# Altium project pcb大作业.PrjPCB
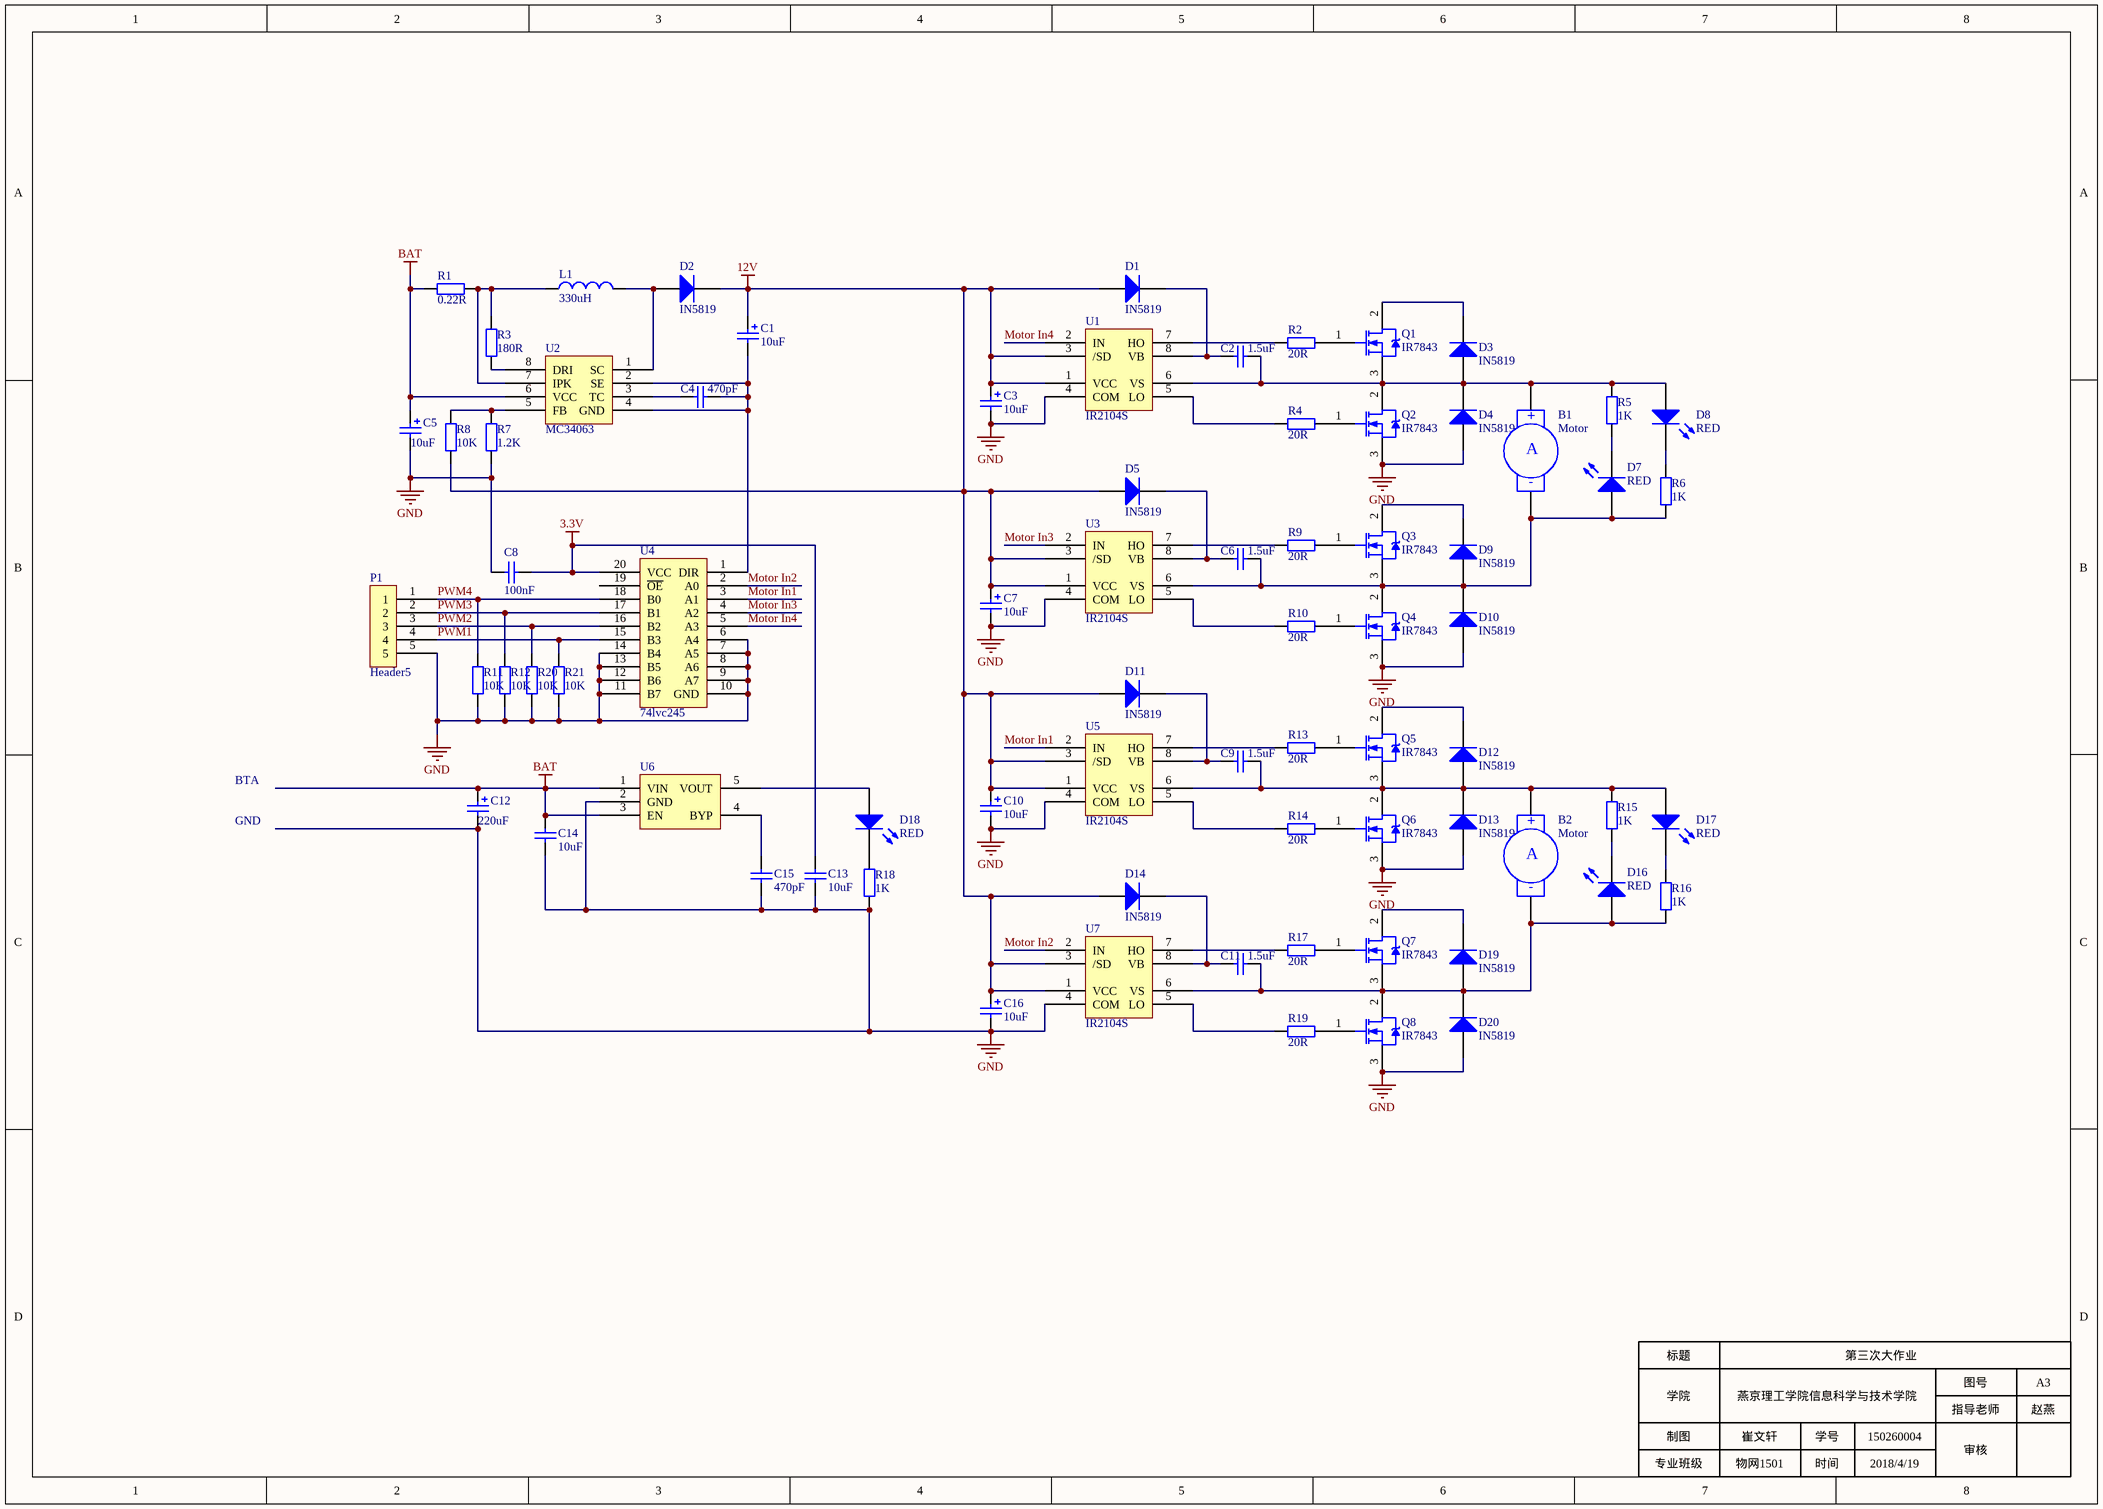
[diagram p0: pcb大作业.SchDoc]
1 sheet, 74 parts. Net scope: global (net labels, ports and power ports of the same name join across sheets).
Board file: pcb大作业.PcbDoc

## Sheet pcb大作业.SchDoc
size A3

### Parts
B1  Motor  [RAD-0.4]
B2  Motor  [RAD-0.4]
C1  value 10uF  [POLAR0.8]  (hidden comment: Cap Pol2)
C2  value 1.5uF  [RAD-0.3]  (hidden comment: Cap)
C3  value 10uF  [POLAR0.8]  (hidden comment: Cap Pol2)
C4  value 470pF  [RAD-0.3]  (hidden comment: Cap)
C5  value 10uF  [POLAR0.8]  (hidden comment: Cap Pol2)
C6  value 1.5uF  [RAD-0.3]  (hidden comment: Cap)
C7  value 10uF  [POLAR0.8]  (hidden comment: Cap Pol2)
C8  value 100nF  [RAD-0.3]  (hidden comment: Cap)
C9  value 1.5uF  [RAD-0.3]  (hidden comment: Cap)
C10  value 10uF  [POLAR0.8]  (hidden comment: Cap Pol2)
C11  value 1.5uF  [RAD-0.3]  (hidden comment: Cap)
C12  value 220uF  [POLAR0.8]  (hidden comment: Cap Pol2)
C13  value 10uF  [RAD-0.3]  (hidden comment: Cap)
C14  value 10uF  [RAD-0.3]  (hidden comment: Cap)
C15  value 470pF  [RAD-0.3]  (hidden comment: Cap)
C16  value 10uF  [POLAR0.8]  (hidden comment: Cap Pol2)
D1  IN5819  [SMC]
D2  IN5819  [SMC]
D3  IN5819  [SMC]
D4  IN5819  [SMC]
D5  IN5819  [SMC]
D7  RED  [LED-0]
D8  RED  [LED-0]
D9  IN5819  [SMC]
D10  IN5819  [SMC]
D11  IN5819  [SMC]
D12  IN5819  [SMC]
D13  IN5819  [SMC]
D14  IN5819  [SMC]
D16  RED  [LED-0]
D17  RED  [LED-0]
D18  RED  [LED-0]
D19  IN5819  [SMC]
D20  IN5819  [SMC]
L1  value 330uH  [0402-A]  (hidden comment: Inductor)
P1  Header5  [Header5]
Q1  IR7843  [TO-220AB]
Q2  IR7843  [TO-220AB]
Q3  IR7843  [TO-220AB]
Q4  IR7843  [TO-220AB]
Q5  IR7843  [TO-220AB]
Q6  IR7843  [TO-220AB]
Q7  IR7843  [TO-220AB]
Q8  IR7843  [TO-220AB]
R1  value 0.22R  [AXIAL-0.4]  (hidden comment: Res2)
R2  value 20R  [AXIAL-0.4]  (hidden comment: Res2)
R3  value 180R  [AXIAL-0.4]  (hidden comment: Res2)
R4  value 20R  [AXIAL-0.4]  (hidden comment: Res2)
R5  value 1K  [AXIAL-0.4]  (hidden comment: Res2)
R6  value 1K  [AXIAL-0.4]  (hidden comment: Res2)
R7  value 1.2K  [AXIAL-0.4]  (hidden comment: Res2)
R8  value 10K  [AXIAL-0.4]  (hidden comment: Res2)
R9  value 20R  [AXIAL-0.4]  (hidden comment: Res2)
R10  value 20R  [AXIAL-0.4]  (hidden comment: Res2)
R11  value 10K  [AXIAL-0.4]  (hidden comment: Res2)
R12  value 10K  [AXIAL-0.4]  (hidden comment: Res2)
R13  value 20R  [AXIAL-0.4]  (hidden comment: Res2)
R14  value 20R  [AXIAL-0.4]  (hidden comment: Res2)
R15  value 1K  [AXIAL-0.4]  (hidden comment: Res2)
R16  value 1K  [AXIAL-0.4]  (hidden comment: Res2)
R17  value 20R  [AXIAL-0.4]  (hidden comment: Res2)
R18  value 1K  [AXIAL-0.4]  (hidden comment: Res2)
R19  value 20R  [AXIAL-0.4]  (hidden comment: Res2)
R20  value 10K  [AXIAL-0.4]  (hidden comment: Res2)
R21  value 10K  [AXIAL-0.4]  (hidden comment: Res2)
U1  IR2104S  [ir2104s]
U2  MC34063  [MC34063]
U3  IR2104S  [ir2104s]
U4  74lvc245  [74lvc245]
U5  IR2104S  [ir2104s]
U6  U6  [u6]  (value not drawn)
U7  IR2104S  [ir2104s]

### Nets
3.3V: C8.2 C13.2 U4.20(VCC)
12V: C1.1 C3.1 C7.1 C10.1 C16.1 D1.1(A) D2.2(K) D5.1(A) D11.1(A) D14.1(A) R8.1 U1.1(VCC) U1.3(/SD) U3.1(VCC) U3.3(/SD) U5.1(VCC) U5.3(/SD) U7.1(VCC) U7.3(/SD)
BAT: C5.1 C12.1 C14.2 R1.1 U2.6(VCC) U6.1(VIN) U6.3(EN)
GND: C3.2 C5.2 C7.2 C8.1 C10.2 C12.2 C13.1 C14.1 C15.1 C16.2 D4.1(A) D10.1(A) D13.1(A) D20.1(A) P1.5 Q2.3(S) Q4.3(S) Q6.3(S) Q8.3(S) R7.1 R11.1 R12.1 R18.1 R20.1 R21.1 U1.4(COM) U3.4(COM) U4.6(A4) U4.7(A5) U4.8(A6) U4.9(A7) U4.10(GND) U4.11(B7) U4.12(B6) U4.13(B5) U4.14(B4) U5.4(COM) U6.2(GND) U7.4(COM)
Motor In1: U4.3(A1) U5.2(IN)
Motor In2: U4.2(A0) U7.2(IN)
Motor In3: U3.2(IN) U4.4(A2)
Motor In4: U1.2(IN) U4.5(A3)
PWM1: P1.4 R21.2 U4.15(B3)
PWM2: P1.3 R20.2 U4.16(B2)
PWM3: P1.2 R12.2 U4.17(B1)
PWM4: P1.1 R11.2 U4.18(B0)
NetB1_1: B1.1(+) C2.2 D3.1(A) D4.2(K) D8.1(A) Q1.3(S) Q2.2(D) R5.2 U1.6(VS)
NetB1_2: B1.2(-) C6.2 D7.1(A) D9.1(A) D10.2(K) Q3.3(S) Q4.2(D) R6.1 U3.6(VS)
NetB2_1: B2.1(+) C9.2 D12.1(A) D13.2(K) D17.1(A) Q5.3(S) Q6.2(D) R15.2 U5.6(VS)
NetB2_2: B2.2(-) C11.2 D16.1(A) D19.1(A) D20.2(K) Q7.3(S) Q8.2(D) R16.1 U7.6(VS)
NetC1_2: C1.2 C4.1 U2.2(SE) U2.4(GND) U4.1(DIR)
NetC2_1: C2.1 D1.2(K) U1.8(VB)
NetC4_2: C4.2 U2.3(TC)
NetC6_1: C6.1 D5.2(K) U3.8(VB)
NetC9_1: C9.1 D11.2(K) U5.8(VB)
NetC11_1: C11.1 D14.2(K) U7.8(VB)
NetC15_2: C15.2 U6.4(BYP)
NetD2_1: D2.1(A) L1.2 U2.1(SC)
NetD3_2: D3.2(K) Q1.2(D)
NetD7_2: D7.2(K) R5.1
NetD8_2: D8.2(K) R6.2
NetD9_2: D9.2(K) Q3.2(D)
NetD12_2: D12.2(K) Q5.2(D)
NetD16_2: D16.2(K) R15.1
NetD17_2: D17.2(K) R16.2
NetD18_1: D18.1(A) U6.5(VOUT)
NetD18_2: D18.2(K) R18.2
NetD19_2: D19.2(K) Q7.2(D)
NetL1_1: L1.1 R1.2 R3.2 U2.7(IPK)
NetQ1_1: Q1.1(G) R2.2
NetQ2_1: Q2.1(G) R4.2
NetQ3_1: Q3.1(G) R9.2
NetQ4_1: Q4.1(G) R10.2
NetQ5_1: Q5.1(G) R13.2
NetQ6_1: Q6.1(G) R14.2
NetQ7_1: Q7.1(G) R17.2
NetQ8_1: Q8.1(G) R19.2
NetR2_1: R2.1 U1.7(HO)
NetR3_1: R3.1 U2.8(DRI)
NetR4_1: R4.1 U1.5(LO)
NetR7_2: R7.2 R8.2 U2.5(FB)
NetR9_1: R9.1 U3.7(HO)
NetR10_1: R10.1 U3.5(LO)
NetR13_1: R13.1 U5.7(HO)
NetR14_1: R14.1 U5.5(LO)
NetR17_1: R17.1 U7.7(HO)
NetR19_1: R19.1 U7.5(LO)

Not connected (* = marked no-connect by the designer): U4 19(~{OE})

### Notes on the sheet
- BTA
- GND
- 标题
- 学院
- 燕京理工学院信息科学与技术学院
- 第三次大作业
- 图号
- A3
- 制图
- 专业班级
- 崔文轩
- 物网1501
- 学号
- 时间
- 150260004
- 2018/4/19
- 指导老师
- 审核
- 赵燕
- (in symbol Motor Servo) A

### Library data of the parts
B1 B2 = Motor Servo: Servo Motor; Published: 24-Mar-1999; LatestRevisionDate: 17-Jul-2002; LatestRevisionNote: Re-released for DXP Platform.; PackageReference: RAD-0.4; Publisher: Altium Limited; PackageDescription: Radial Cap, Thru-Hole; 2 Leads; 0.4 in Pin Spacing
C1 C3 C5 C7 C10 C12 C16 = Cap Pol2: Polarized Capacitor (Axial); Published: 8-Jun-2000; LatestRevisionDate: 17-Jul-2002; LatestRevisionNote: Re-released for DXP Platform.; PackageReference: POLAR0.8; Publisher: Altium Limited; PackageDescription: Polarized Capacitor; 2 Leads
C2 C4 C6 C8 C9 C11 C13-C15 = Cap: Capacitor; Published: 8-Jun-2000; LatestRevisionDate: 17-Jul-2002; LatestRevisionNote: Re-released for DXP Platform.; PackageReference: RAD-0.3; Publisher: Altium Limited; PackageDescription: Radial Cap, Thru-Hole; 2 Leads; 0.3 in Pin Spacing
D1-D5 D9-D14 D19 D20 = Diode: Default Diode; Published: 8-Jun-2000; LatestRevisionDate: 17-Jul-2002; LatestRevisionNote: Re-released for DXP Platform.; PackageVersion: Sep-1996; PackageReference: SMC; Publisher: Altium Limited; PackageDescription: DO-214-AB/SMC; 2 C-Bend Leads; Body 7.9 x 5.9 mm, inc. leads (LxW); Code_JEDEC: DO-214-AB
D7 D8 D16-D18 = LED0: Typical INFRARED GaAs LED; Published: 8-Jun-2000; LatestRevisionDate: 08-Jul-2005; LatestRevisionNote: Mech Layer 1 removed.; PackageReference: LED-0; Publisher: Altium Limited; PackageDescription: LED; 2 Leads
L1 = Inductor: Code_IEC: 1005; Published: 8-Jun-2000; LatestRevisionDate: 29-May-2009; LatestRevisionNote: IPC-7351 Footprint Added.; PackageReference: 0402-A; Publisher: Altium Limited; PackageDescription: Chip Inductor; Code_JEITA: 0402
Q1-Q8 = NMOS-2: N-Channel Power MOSFET; Note: Pin 2 is electrically connected to pin 4.; Published: 8-Jun-2000; LatestRevisionDate: 17-Jul-2002; LatestRevisionNote: Re-released for DXP Platform.; DatasheetVersion: PD-9.814; PackageVersion: Feb-1997; PackageReference: TO-220AB; Publisher: Altium Limited; PackageDescription: TO, Thru-Hole, Vertical, Heatsink Mounted; 3 In-Line Leads; Pitch 2.54 mm; ComponentLink1Description: Manufacturer Link; ComponentLink1URL: http://www.irf.com/
R1-R21 = Res2: Resistor; Published: 8-Jun-2000; LatestRevisionDate: 17-Jul-2002; LatestRevisionNote: Re-released for DXP Platform.; PackageReference: AXIAL-0.4; Publisher: Altium Limited; PackageDescription: Axial Device, Thru-Hole; 2 Leads; 0.4 in Pin Spacing